# Altium schematic sheet MainBoard.SchDoc: Main Board
size A4; DrawnBy: M. Schwegler; Organization: HSLU T&A; Address1: Abteilung Elektrotechnik; Address2: Technikumsstrasse 21; Address3: CH-6048 Horw; Revision: v1; SheetNumber: 2; SheetTotal: 2; Projektname: SmartBoard; DocumentName: MainBoard; ProjectName: SmartBoard
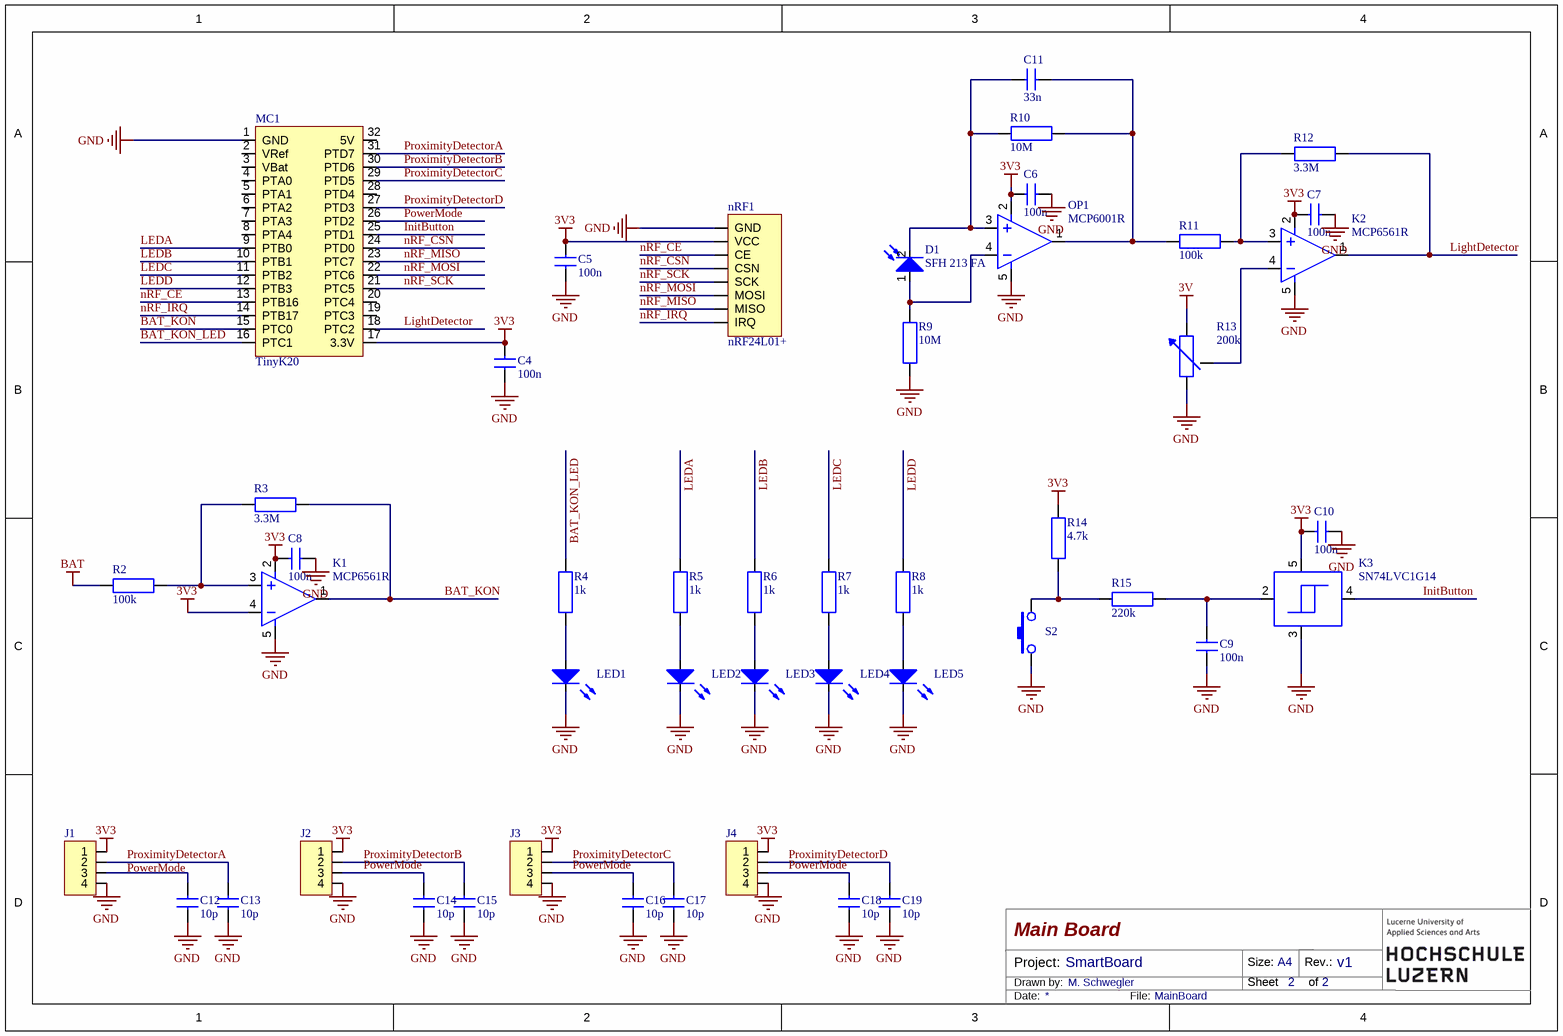
[diagram p0: MainBoard.SchDoc]

## Parts
C4  100n  [0805_C]
C5  100n  [0805_C]
C6  100n  [0805_C]
C7  100n  [0805_C]
C8  100n  [0805_C]
C9  100n  [0805_C]
C10  100n  [0805_C]
C11  33n  [0805_C]
C12  10p  [0805_C]
C13  10p  [0805_C]
C14  10p  [0805_C]
C15  10p  [0805_C]
C16  10p  [0805_C]
C17  10p  [0805_C]
C18  10p  [0805_C]
C19  10p  [0805_C]
D1  SFH 213 FA  [LED_THT_5mm_RM_2.54mm]
J1  (no value)  [CON_THT_4P_RM2.54]
J2  (no value)  [CON_THT_4P_RM2.54]
J3  (no value)  [CON_THT_4P_RM2.54]
J4  (no value)  [CON_THT_4P_RM2.54]
K1  MCP6561R  [SOT23-5]
K2  MCP6561R  [SOT23-5]
K3  SN74LVC1G14  [SOT23-5]
LED1  (no value)  [LED_THT_3mm_RM_2.54mm]
LED2  (no value)  [LED_THT_3mm_RM_2.54mm]
LED3  (no value)  [LED_THT_3mm_RM_2.54mm]
LED4  (no value)  [LED_THT_3mm_RM_2.54mm]
LED5  (no value)  [LED_THT_3mm_RM_2.54mm]
MC1  TinyK20  [DIP32]
nRF1  nRF24L01+  [CON_THT_2x4P_RM2.54_Stiftl]
OP1  MCP6001R  [SOT23-5]
R2  100k  [0805_R]
R3  3.3M  [0805_R]
R4  1k  [0805_R]
R5  1k  [0805_R]
R6  1k  [0805_R]
R7  1k  [0805_R]
R8  1k  [0805_R]
R9  10M  [0805_R]
R10  10M  [0805_R]
R11  100k  [0805_R]
R12  3.3M  [0805_R]
R13  200k  [Poti]
R14  4.7k  [0805_R]
R15  220k  [0805_r]
S2  S2  [SIP2]  (value not drawn)

## Nets
3V: R13.3
3V3: C4.2 C5.2 C6.1 C7.1 C8.1 C10.1 J1.1 J2.1 J3.1 J4.1 K1.2 K1.4 K2.2 K3.5 MC1.17(3.3V) nRF1.2(VCC) OP1.2 R14.1
BAT: R2.2
GND: C4.1 C5.1 C6.2 C7.2 C8.2 C9.1 C10.2 C12.1 C13.1 C14.1 C15.1 C16.1 C17.1 C18.1 C19.1 J1.4 J2.4 J3.4 J4.4 K1.5 K2.5 K3.3 LED1.2(K) LED2.2(K) LED3.2(K) LED4.2(K) LED5.2(K) MC1.1(GND) nRF1.1(GND) OP1.5 R9.2 R13.1 S2.1
BAT_KON: K1.1 MC1.15(PTC0) R3.1
BAT_KON_LED: MC1.16(PTC1) R4.1
InitButton: K3.4 MC1.25(PTD1)
LEDA: MC1.9(PTB0) R5.1
LEDB: MC1.10(PTB1) R6.1
LEDC: MC1.11(PTB2) R7.1
LEDD: MC1.12(PTB3) R8.1
LightDetector: K2.1 MC1.18(PTC2) R12.1
nRF_CE: MC1.13(PTB16) nRF1.3(CE)
nRF_CSN: MC1.24(PTD0) nRF1.4(CSN)
nRF_IRQ: MC1.14(PTB17) nRF1.8(IRQ)
nRF_MISO: MC1.23(PTC7) nRF1.7(MISO)
nRF_MOSI: MC1.22(PTC6) nRF1.6(MOSI)
nRF_SCK: MC1.21(PTC5) nRF1.5(SCK)
PowerMode: C14.2 C16.2 C18.2 J2.3 J3.3 J4.3 MC1.26(PTD2)
ProximityDetectorA: C13.2 J1.2 MC1.31(PTD7)
ProximityDetectorB: C15.2 J2.2 MC1.30(PTD6)
ProximityDetectorC: C17.2 J3.2 MC1.29(PTD5)
ProximityDetectorD: C19.2 J4.2 MC1.27(PTD3)
NetC9_2: C9.2 K3.2 R15.2
NetC11_1: C11.1 D1.2(K) OP1.3 R10.2
NetC11_2: C11.2 OP1.1 R10.1 R11.2
NetC12_2: C12.2 J1.3
NetD1_1: D1.1(A) OP1.4 R9.1
NetK1_3: K1.3 R2.1 R3.2
NetK2_3: K2.3 R11.1 R12.2
NetK2_4: K2.4 R13.2
NetLED1_1: LED1.1(A) R4.2
NetLED2_1: LED2.1(A) R5.2
NetLED3_1: LED3.1(A) R6.2
NetLED4_1: LED4.1(A) R7.2
NetLED5_1: LED5.1(A) R8.2
NetR14_2: R14.2 R15.1 S2.2

Not connected (* = marked no-connect by the designer): MC1 2(VRef) 3(VBat) 4(PTA0) 5(PTA1) 6(PTA2) 7(PTA3) 8(PTA4) 19(PTC3) 20(PTC4) 28(PTD4) 32(5V)

## Notes on the sheet
- Labels drawn without touching a wire or pin: PowerMode
- Project:
- Drawn by:
- Size:
- Sheet
- A4
- Rev.:
- of
- Date:
- File:

## Library data of the parts
C4-C19 = C?: Normaler Kondensator
D1 = Photo_Diode_1A_2K
J1-J4 = CON_4P
K1 K2 OP1 = OPAMP
K3 = schmitt
LED1-LED5 = LED
nRF1 = Bluefruit
R2-R12 R14 R15 = R?: Normaler Widerstand
R13 = R? {RPAR}: Variabler Widerstand
S2 = SW-PB